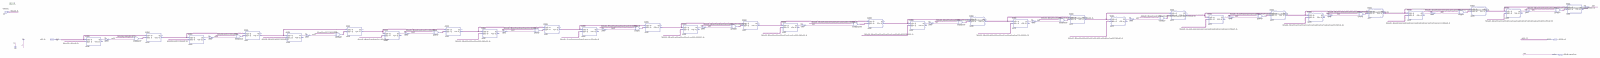
[diagram p0: schematic sheet, whole]
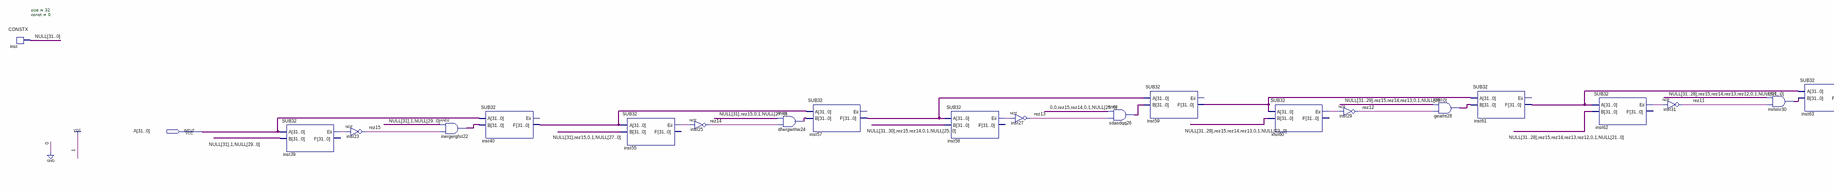
[diagram p1: schematic sheet, left part]
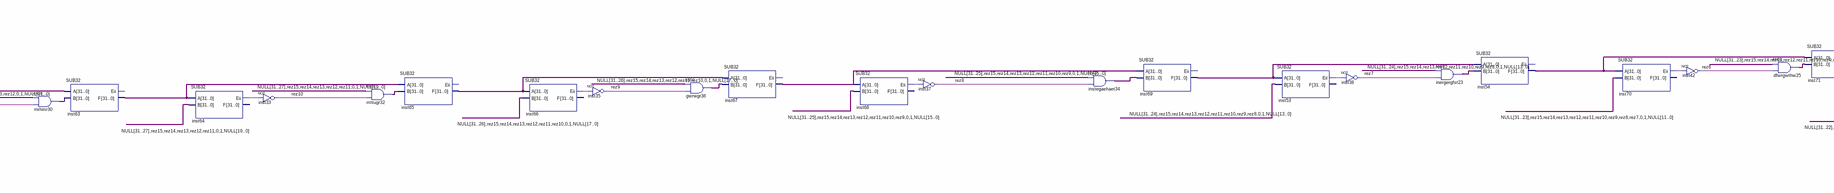
[diagram p2: schematic sheet, centre part]
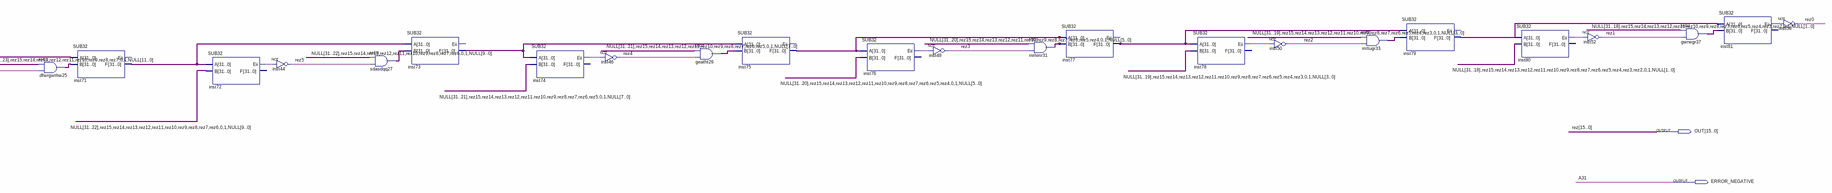
[diagram p3: schematic sheet, right part]
// Quartus schematic SQRT32.bdf as structural Verilog: 62 symbols, 3 pins
module SQRT32 (
  input  [31:0] A,
  output [15:0] OUT,
  output ERROR_NEGATIVE
);

  wire inst39_eii, inst53_eii, inst55_eii, inst58_eii, inst60_eii, inst62_eii, inst64_eii, inst66_eii,
       inst68_eii, inst70_eii, inst72_eii, inst74_eii, inst76_eii, inst78_eii, inst80_eii, inst81_eii;
  wire [31:0] dfwrgwthw24_out, dfwrgwthw25_out, geatht28_out, geatht29_out, gwrwgr36_out, gwrwgr37_out,
       inergergfst22_out, inergergfst23_out, inst40_f, inst54_f, inst57_f, inst59_f, inst61_f, inst63_f,
       inst65_f, inst67_f, inst69_f, inst71_f, inst73_f, inst75_f, inst77_f, inst79_f, instegaehaet34_out,
       mttugr32_out, mttugr33_out, NULL, rnrhmr30_out, rnrhmr31_out, sdasdqq26_out, sdasdqq27_out;

  CONSTX #(.size(32), .\const (0)) inst (.data(NULL));
  SUB32 inst39 (.A(A), .B({NULL[31], 1'b1, NULL[29:0]}), .Eii(inst39_eii));  // open: F
  not inst23 (OUT[15], inst39_eii);
  assign inergergfst22_out = {NULL[31], 1'b1, NULL[29:0]} & {32{OUT[15]}};  // AND2 inergergfst22, 32 bits wide
  SUB32 inst40 (.A(A), .B(inergergfst22_out), .F(inst40_f));  // open: Eii
  SUB32 inst55 (.A(inst40_f), .B({NULL[31], OUT[15], 2'b01, NULL[27:0]}), .Eii(inst55_eii));  // open: F
  not inst25 (OUT[14], inst55_eii);
  assign dfwrgwthw24_out = {NULL[31], OUT[15], 2'b01, NULL[27:0]} & {32{OUT[14]}};  // AND2 dfwrgwthw24, 32 bits wide
  SUB32 inst57 (.A(inst40_f), .B(dfwrgwthw24_out), .F(inst57_f));  // open: Eii
  SUB32 inst58 (.A(inst57_f), .B({NULL[31:30], OUT[15:14], 2'b01, NULL[25:0]}), .Eii(inst58_eii));  // open: F
  not inst27 (OUT[13], inst58_eii);
  assign sdasdqq26_out = {2'b00, OUT[15:14], 2'b01, NULL[25:0]} & {32{OUT[13]}};  // AND2 sdasdqq26, 32 bits wide
  SUB32 inst59 (.A(inst57_f), .B(sdasdqq26_out), .F(inst59_f));  // open: Eii
  SUB32 inst60 (.A(inst59_f), .B({NULL[31:29], OUT[15:13], 2'b01, NULL[23:0]}), .Eii(inst60_eii));  // open: F
  not inst29 (OUT[12], inst60_eii);
  assign geatht28_out = {NULL[31:29], OUT[15:13], 2'b01, NULL[23:0]} & {32{OUT[12]}};  // AND2 geatht28, 32 bits wide
  SUB32 inst61 (.A(inst59_f), .B(geatht28_out), .F(inst61_f));  // open: Eii
  SUB32 inst62 (.A(inst61_f), .B({NULL[31:28], OUT[15:12], 2'b01, NULL[21:0]}), .Eii(inst62_eii));  // open: F
  not inst31 (OUT[11], inst62_eii);
  assign rnrhmr30_out = {NULL[31:28], OUT[15:12], 2'b01, NULL[21:0]} & {32{OUT[11]}};  // AND2 rnrhmr30, 32 bits wide
  SUB32 inst63 (.A(inst61_f), .B(rnrhmr30_out), .F(inst63_f));  // open: Eii
  SUB32 inst64 (.A(inst63_f), .B({NULL[31:27], OUT[15:11], 2'b01, NULL[19:0]}), .Eii(inst64_eii));  // open: F
  not inst33 (OUT[10], inst64_eii);
  assign mttugr32_out = {NULL[31:27], OUT[15:11], 2'b01, NULL[19:0]} & {32{OUT[10]}};  // AND2 mttugr32, 32 bits wide
  SUB32 inst65 (.A(inst63_f), .B(mttugr32_out), .F(inst65_f));  // open: Eii
  SUB32 inst66 (.A(inst65_f), .B({NULL[31:26], OUT[15:10], 2'b01, NULL[17:0]}), .Eii(inst66_eii));  // open: F
  not inst35 (OUT[9], inst66_eii);
  assign gwrwgr36_out = {NULL[31:26], OUT[15:10], 2'b01, NULL[17:0]} & {32{OUT[9]}};  // AND2 gwrwgr36, 32 bits wide
  SUB32 inst67 (.A(inst65_f), .B(gwrwgr36_out), .F(inst67_f));  // open: Eii
  SUB32 inst68 (.A(inst67_f), .B({NULL[31:25], OUT[15:9], 2'b01, NULL[15:0]}), .Eii(inst68_eii));  // open: F
  not inst37 (OUT[8], inst68_eii);
  assign instegaehaet34_out = {NULL[31:25], OUT[15:9], 2'b01, NULL[15:0]} & {32{OUT[8]}};  // AND2 instegaehaet34, 32 bits wide
  SUB32 inst69 (.A(inst67_f), .B(instegaehaet34_out), .F(inst69_f));  // open: Eii
  SUB32 inst53 (.A(inst69_f), .B({NULL[31:24], OUT[15:8], 2'b01, NULL[13:0]}), .Eii(inst53_eii));  // open: F
  not inst38 (OUT[7], inst53_eii);
  assign inergergfst23_out = {NULL[31:24], OUT[15:8], 2'b01, NULL[13:0]} & {32{OUT[7]}};  // AND2 inergergfst23, 32 bits wide
  SUB32 inst54 (.A(inst69_f), .B(inergergfst23_out), .F(inst54_f));  // open: Eii
  SUB32 inst70 (.A(inst54_f), .B({NULL[31:23], OUT[15:7], 2'b01, NULL[11:0]}), .Eii(inst70_eii));  // open: F
  not inst42 (OUT[6], inst70_eii);
  assign dfwrgwthw25_out = {NULL[31:23], OUT[15:7], 2'b01, NULL[11:0]} & {32{OUT[6]}};  // AND2 dfwrgwthw25, 32 bits wide
  SUB32 inst71 (.A(inst54_f), .B(dfwrgwthw25_out), .F(inst71_f));  // open: Eii
  SUB32 inst72 (.A(inst71_f), .B({NULL[31:22], OUT[15:6], 2'b01, NULL[9:0]}), .Eii(inst72_eii));  // open: F
  not inst44 (OUT[5], inst72_eii);
  assign sdasdqq27_out = {NULL[31:22], OUT[15:6], 2'b01, NULL[9:0]} & {32{OUT[5]}};  // AND2 sdasdqq27, 32 bits wide
  SUB32 inst73 (.A(inst71_f), .B(sdasdqq27_out), .F(inst73_f));  // open: Eii
  SUB32 inst74 (.A(inst73_f), .B({NULL[31:21], OUT[15:5], 2'b01, NULL[7:0]}), .Eii(inst74_eii));  // open: F
  not inst46 (OUT[4], inst74_eii);
  assign geatht29_out = {NULL[31:21], OUT[15:5], 2'b01, NULL[7:0]} & {32{OUT[4]}};  // AND2 geatht29, 32 bits wide
  SUB32 inst75 (.A(inst73_f), .B(geatht29_out), .F(inst75_f));  // open: Eii
  SUB32 inst76 (.A(inst75_f), .B({NULL[31:20], OUT[15:4], 2'b01, NULL[5:0]}), .Eii(inst76_eii));  // open: F
  not inst48 (OUT[3], inst76_eii);
  assign rnrhmr31_out = {NULL[31:20], OUT[15:4], 2'b01, NULL[5:0]} & {32{OUT[3]}};  // AND2 rnrhmr31, 32 bits wide
  SUB32 inst77 (.A(inst75_f), .B(rnrhmr31_out), .F(inst77_f));  // open: Eii
  SUB32 inst78 (.A(inst77_f), .B({NULL[31:19], OUT[15:3], 2'b01, NULL[3:0]}), .Eii(inst78_eii));  // open: F
  not inst50 (OUT[2], inst78_eii);
  assign mttugr33_out = {NULL[31:19], OUT[15:3], 2'b01, NULL[3:0]} & {32{OUT[2]}};  // AND2 mttugr33, 32 bits wide
  SUB32 inst79 (.A(inst77_f), .B(mttugr33_out), .F(inst79_f));  // open: Eii
  SUB32 inst80 (.A(inst79_f), .B({NULL[31:18], OUT[15:2], 2'b01, NULL[1:0]}), .Eii(inst80_eii));  // open: F
  not inst52 (OUT[1], inst80_eii);
  assign gwrwgr37_out = {NULL[31:18], OUT[15:2], 2'b01, NULL[1:0]} & {32{OUT[1]}};  // AND2 gwrwgr37, 32 bits wide
  SUB32 inst81 (.A(inst79_f), .B(gwrwgr37_out), .Eii(inst81_eii));  // open: F
  not inst56 (OUT[0], inst81_eii);

  assign ERROR_NEGATIVE = A[31];

  // Other names for the same wires on the sheet: rez[15:0] = OUT; rez0 = OUT[0]; rez1 = OUT[1]; rez2 = OUT[2];
  //   rez3 = OUT[3]; rez4 = OUT[4]; rez5 = OUT[5]; rez6 = OUT[6]; rez7 = OUT[7]; rez8 = OUT[8]; rez9 = OUT[9];
  //   rez10 = OUT[10]; rez11 = OUT[11]; rez12 = OUT[12]; rez13 = OUT[13]; rez14 = OUT[14]; rez15 = OUT[15]
endmodule
